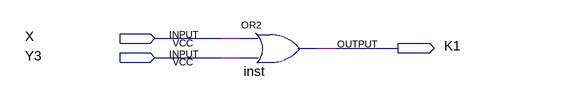
[diagram p0: schematic sheet]
// Quartus schematic K1.bdf as structural Verilog: 1 symbols, 3 pins
module K1 (
  input  X,
  input  Y3,
  output K1
);

  or inst (K1, X, Y3);
endmodule
